# EAGLE schematic in3watch (EAGLE 6.4)

## Sheet 1 of 5: MCU
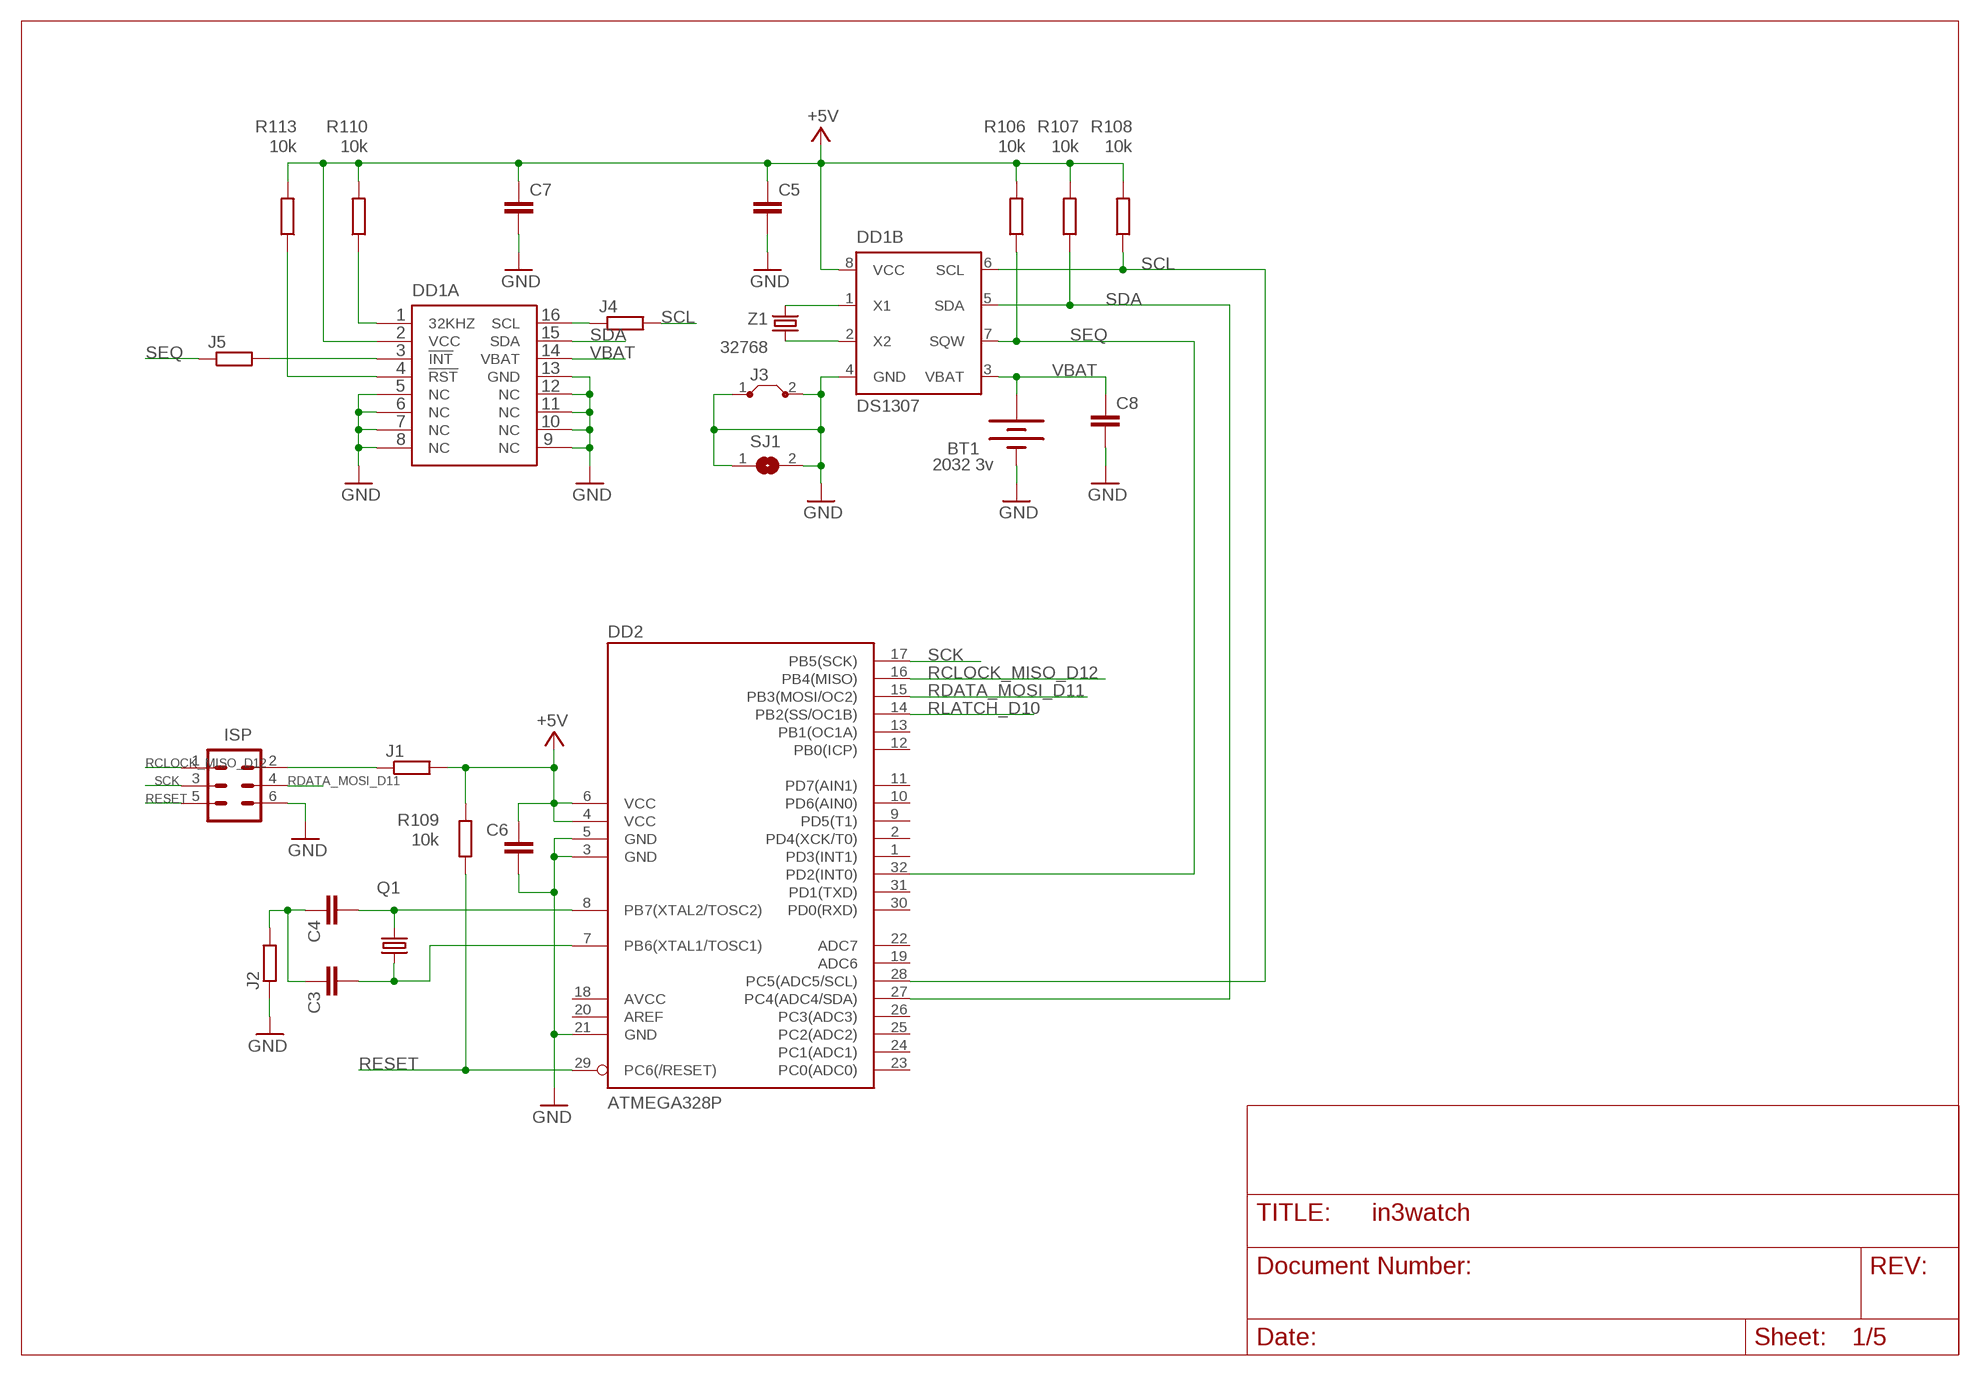
[diagram p0: schematic, sheet 1]

### Parts
BT1  2032 3v  BATTERY-20MM_PTH  [BATTCOM_20MM_PTH]
C3  C-EUC0805  [C0805]
C4  C-EUC0805  [C0805]
C5  C-EUC0805  [C0805]
C6  C-EUC0805  [C0805]
C7  C-EUC0805  [C0805]
C8  C-EUC3225  [C3225]
DD1A  DS3231SOIC-16W  [SOIC-16W]
DD1B  DS1307  [DIL08]
DD2  ATMEGA328P  MEGA8-AI  [TQFP32-08]
ISP  MA03-2  [MA03-2]
J1  R-EU_R1206  [R1206]
J2  R-EU_R1206  [R1206]
J3  J5MM  [05]
J4  R-EU_R1206W  [R1206W]
J5  R-EU_R1206W  [R1206W]
Q1  CRYSTALHC49U70  [HC49U70]
R106  10k  R-EU_R0805  [R0805]
R107  10k  R-EU_R0805  [R0805]
R108  10k  R-EU_R0805  [R0805]
R109  10k  R-EU_R0805  [R0805]
R110  10k  R-EU_R0805  [R0805]
R113  10k  R-EU_R0805  [R0805]
SJ1  SJ  [SJ]
Z1  32768  FC-12M  [FC-12M]

### Nets
+5V: C5.1 C6.1 C7.1 DD1A.2(VCC) DD1B.8(VCC) DD2.4(VCC) DD2.6(VCC) J1.2 R106.2 R107.2 R108.2 R109.2 R110.2 R113.2 ; also sheet 2
+5VISP: ISP.2 J1.1
GND: BT1.2(-) C5.2 C6.2 C7.2 C8.2 DD1A.5(NC) DD1A.6(NC) DD1A.7(NC) DD1A.8(NC) DD1A.9(NC) DD1A.10(NC) DD1A.11(NC) DD1A.12(NC) DD1A.13(GND) DD1B.4(GND) DD2.3(GND) DD2.5(GND) DD2.21(GND) ISP.6 J2.1 J3.1 J3.2 SJ1.1 SJ1.2 ; also sheet 2,4,5
N$31: DD1B.2(X2) Z1.P$1
N$33: DD1B.1(X1) Z1.P$2
N$72: C4.2 DD2.8(PB7(XTAL2/TOSC2)) Q1.1
N$76: C3.1 C4.1 J2.2
N$112: C3.2 DD2.7(PB6(XTAL1/TOSC1)) Q1.2
N$114: DD1A.1(32KHZ) R110.1
N$115: DD1A.4(!RST) R113.1
RCLOCK_MISO_D12: DD2.16(PB4(MISO)) ISP.1 ; also sheet 2
RDATA_MOSI_D11: DD2.15(PB3(MOSI/OC2)) ISP.4 ; also sheet 2
RESET: DD2.29(PC6(/RESET)) ISP.5 R109.1
RLATCH_D10: DD2.14(PB2(SS/OC1B)) ; also sheet 2
SCK: DD2.17(PB5(SCK)) ISP.3
SCL: DD1B.6(SCL) DD2.28(PC5(ADC5/SCL)) J4.2 R108.1
SCL_J: DD1A.16(SCL) J4.1
SDA: DD1A.15(SDA) DD1B.5(SDA) DD2.27(PC4(ADC4/SDA)) R107.1
SEQ: DD1B.7(SQW) DD2.32(PD2(INT0)) J5.1 R106.1
SEQ_J: DD1A.3(!INT) J5.2
VBAT: BT1.1(+) C8.1 DD1A.14(VBAT) DD1B.3(VBAT)
Unconnected: DD2.1(PD3(INT1)) DD2.2(PD4(XCK/T0)) DD2.9(PD5(T1)) DD2.10(PD6(AIN0)) DD2.11(PD7(AIN1)) DD2.12(PB0(ICP)) DD2.13(PB1(OC1A)) DD2.19(ADC6) DD2.20(AREF) DD2.22(ADC7) DD2.23(PC0(ADC0)) DD2.24(PC1(ADC1)) DD2.25(PC2(ADC2)) DD2.26(PC3(ADC3)) DD2.30(PD0(RXD)) DD2.31(PD1(TXD))

## Sheet 2 of 5: REG
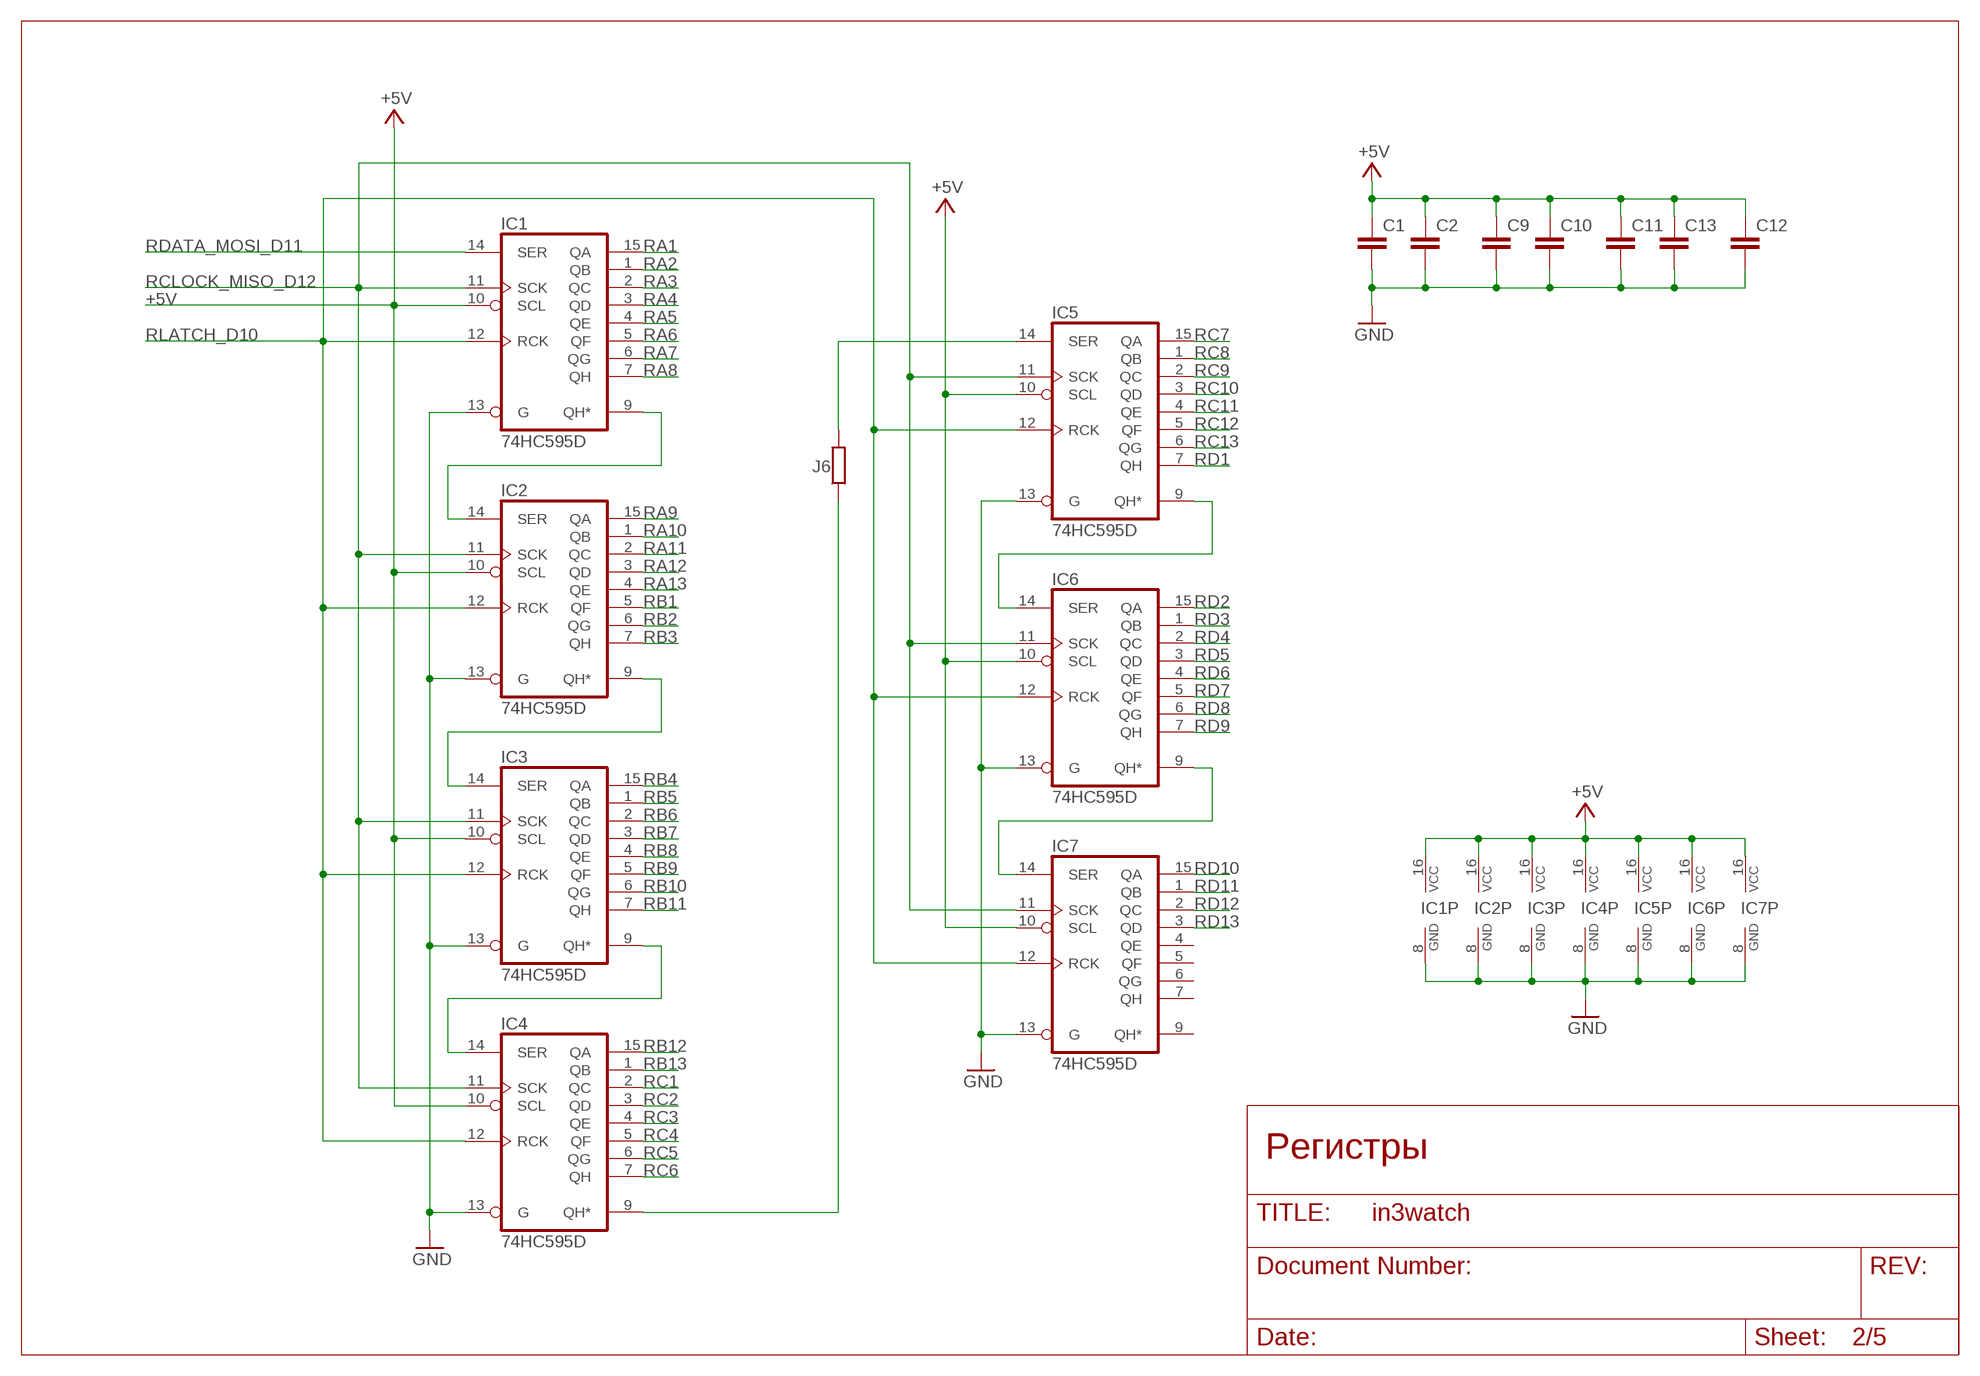
[diagram p1: schematic, sheet 2]

### Parts
C1  C-EUC0805  [C0805]
C2  C-EUC0805  [C0805]
C9  C-EUC0805  [C0805]
C10  C-EUC0805  [C0805]
C11  C-EUC0805  [C0805]
C12  C-EUC0805  [C0805]
C13  C-EUC0805  [C0805]
IC1  74HC595D  [SO16]
IC2  74HC595D  [SO16]
IC3  74HC595D  [SO16]
IC4  74HC595D  [SO16]
IC5  74HC595D  [SO16]
IC6  74HC595D  [SO16]
IC7  74HC595D  [SO16]
J6  R-EU_R1206W  [R1206W]

### Nets
+5V: C1.1 C2.1 C9.1 C10.1 C11.1 C12.1 C13.1 IC1.10(SCL) IC1.16(VCC) IC2.10(SCL) IC2.16(VCC) IC3.10(SCL) IC3.16(VCC) IC4.10(SCL) IC4.16(VCC) IC5.10(SCL) IC5.16(VCC) IC6.10(SCL) IC6.16(VCC) IC7.10(SCL) IC7.16(VCC) ; also sheet 1
GND: C1.2 C2.2 C9.2 C10.2 C11.2 C12.2 C13.2 IC1.8(GND) IC1.13(G) IC2.8(GND) IC2.13(G) IC3.8(GND) IC3.13(G) IC4.8(GND) IC4.13(G) IC5.8(GND) IC5.13(G) IC6.8(GND) IC6.13(G) IC7.8(GND) IC7.13(G) ; also sheet 1,4,5
N$17: IC5.14(SER) J6.2
RA1: IC1.15(QA) ; also sheet 4
RA2: IC1.1(QB) ; also sheet 4
RA3: IC1.2(QC) ; also sheet 4
RA4: IC1.3(QD) ; also sheet 4
RA5: IC1.4(QE) ; also sheet 4
RA6: IC1.5(QF) ; also sheet 4
RA7: IC1.6(QG) ; also sheet 4
RA8: IC1.7(QH) ; also sheet 4
RA9: IC2.15(QA) ; also sheet 4
RA10: IC2.1(QB) ; also sheet 4
RA11: IC2.2(QC) ; also sheet 4
RA12: IC2.3(QD) ; also sheet 4
RA13: IC2.4(QE) ; also sheet 4
RB1: IC2.5(QF) ; also sheet 4
RB2: IC2.6(QG) ; also sheet 4
RB3: IC2.7(QH) ; also sheet 4
RB4: IC3.15(QA) ; also sheet 4
RB5: IC3.1(QB) ; also sheet 4
RB6: IC3.2(QC) ; also sheet 4
RB7: IC3.3(QD) ; also sheet 4
RB8: IC3.4(QE) ; also sheet 4
RB9: IC3.5(QF) ; also sheet 4
RB10: IC3.6(QG) ; also sheet 4
RB11: IC3.7(QH) ; also sheet 4
RB12: IC4.15(QA) ; also sheet 4
RB13: IC4.1(QB) ; also sheet 4
RC1: IC4.2(QC) ; also sheet 4
RC2: IC4.3(QD) ; also sheet 4
RC3: IC4.4(QE) ; also sheet 4
RC4: IC4.5(QF) ; also sheet 4
RC5: IC4.6(QG) ; also sheet 4
RC6: IC4.7(QH) ; also sheet 4
RC7: IC5.15(QA) ; also sheet 5
RC8: IC5.1(QB) ; also sheet 5
RC9: IC5.2(QC) ; also sheet 5
RC10: IC5.3(QD) ; also sheet 5
RC11: IC5.4(QE) ; also sheet 5
RC12: IC5.5(QF) ; also sheet 5
RC13: IC5.6(QG) ; also sheet 5
RCLOCK_MISO_D12: IC1.11(SCK) IC2.11(SCK) IC3.11(SCK) IC4.11(SCK) IC5.11(SCK) IC6.11(SCK) IC7.11(SCK) ; also sheet 1
RD1: IC5.7(QH) ; also sheet 5
RD2: IC6.15(QA) ; also sheet 5
RD3: IC6.1(QB) ; also sheet 5
RD4: IC6.2(QC) ; also sheet 5
RD5: IC6.3(QD) ; also sheet 5
RD6: IC6.4(QE) ; also sheet 5
RD7: IC6.5(QF) ; also sheet 5
RD8: IC6.6(QG) ; also sheet 5
RD9: IC6.7(QH) ; also sheet 5
RD10: IC7.15(QA) ; also sheet 5
RD11: IC7.1(QB) ; also sheet 5
RD12: IC7.2(QC) ; also sheet 5
RD13: IC7.3(QD) ; also sheet 5
RDATA_MOSI_D11: IC1.14(SER) ; also sheet 1
RLATCH_D10: IC1.12(RCK) IC2.12(RCK) IC3.12(RCK) IC4.12(RCK) IC5.12(RCK) IC6.12(RCK) IC7.12(RCK) ; also sheet 1
SER2: IC1.9(QH*) IC2.14(SER)
SER3: IC2.9(QH*) IC3.14(SER)
SER4: IC3.9(QH*) IC4.14(SER)
SER5: IC4.9(QH*) J6.1
SER6: IC5.9(QH*) IC6.14(SER)
SER7: IC6.9(QH*) IC7.14(SER)
Unconnected: IC7.4(QE) IC7.5(QF) IC7.6(QG) IC7.7(QH) IC7.9(QH*)

### Notes on the sheet
- Регистры

## Sheet 3 of 5: DSPL
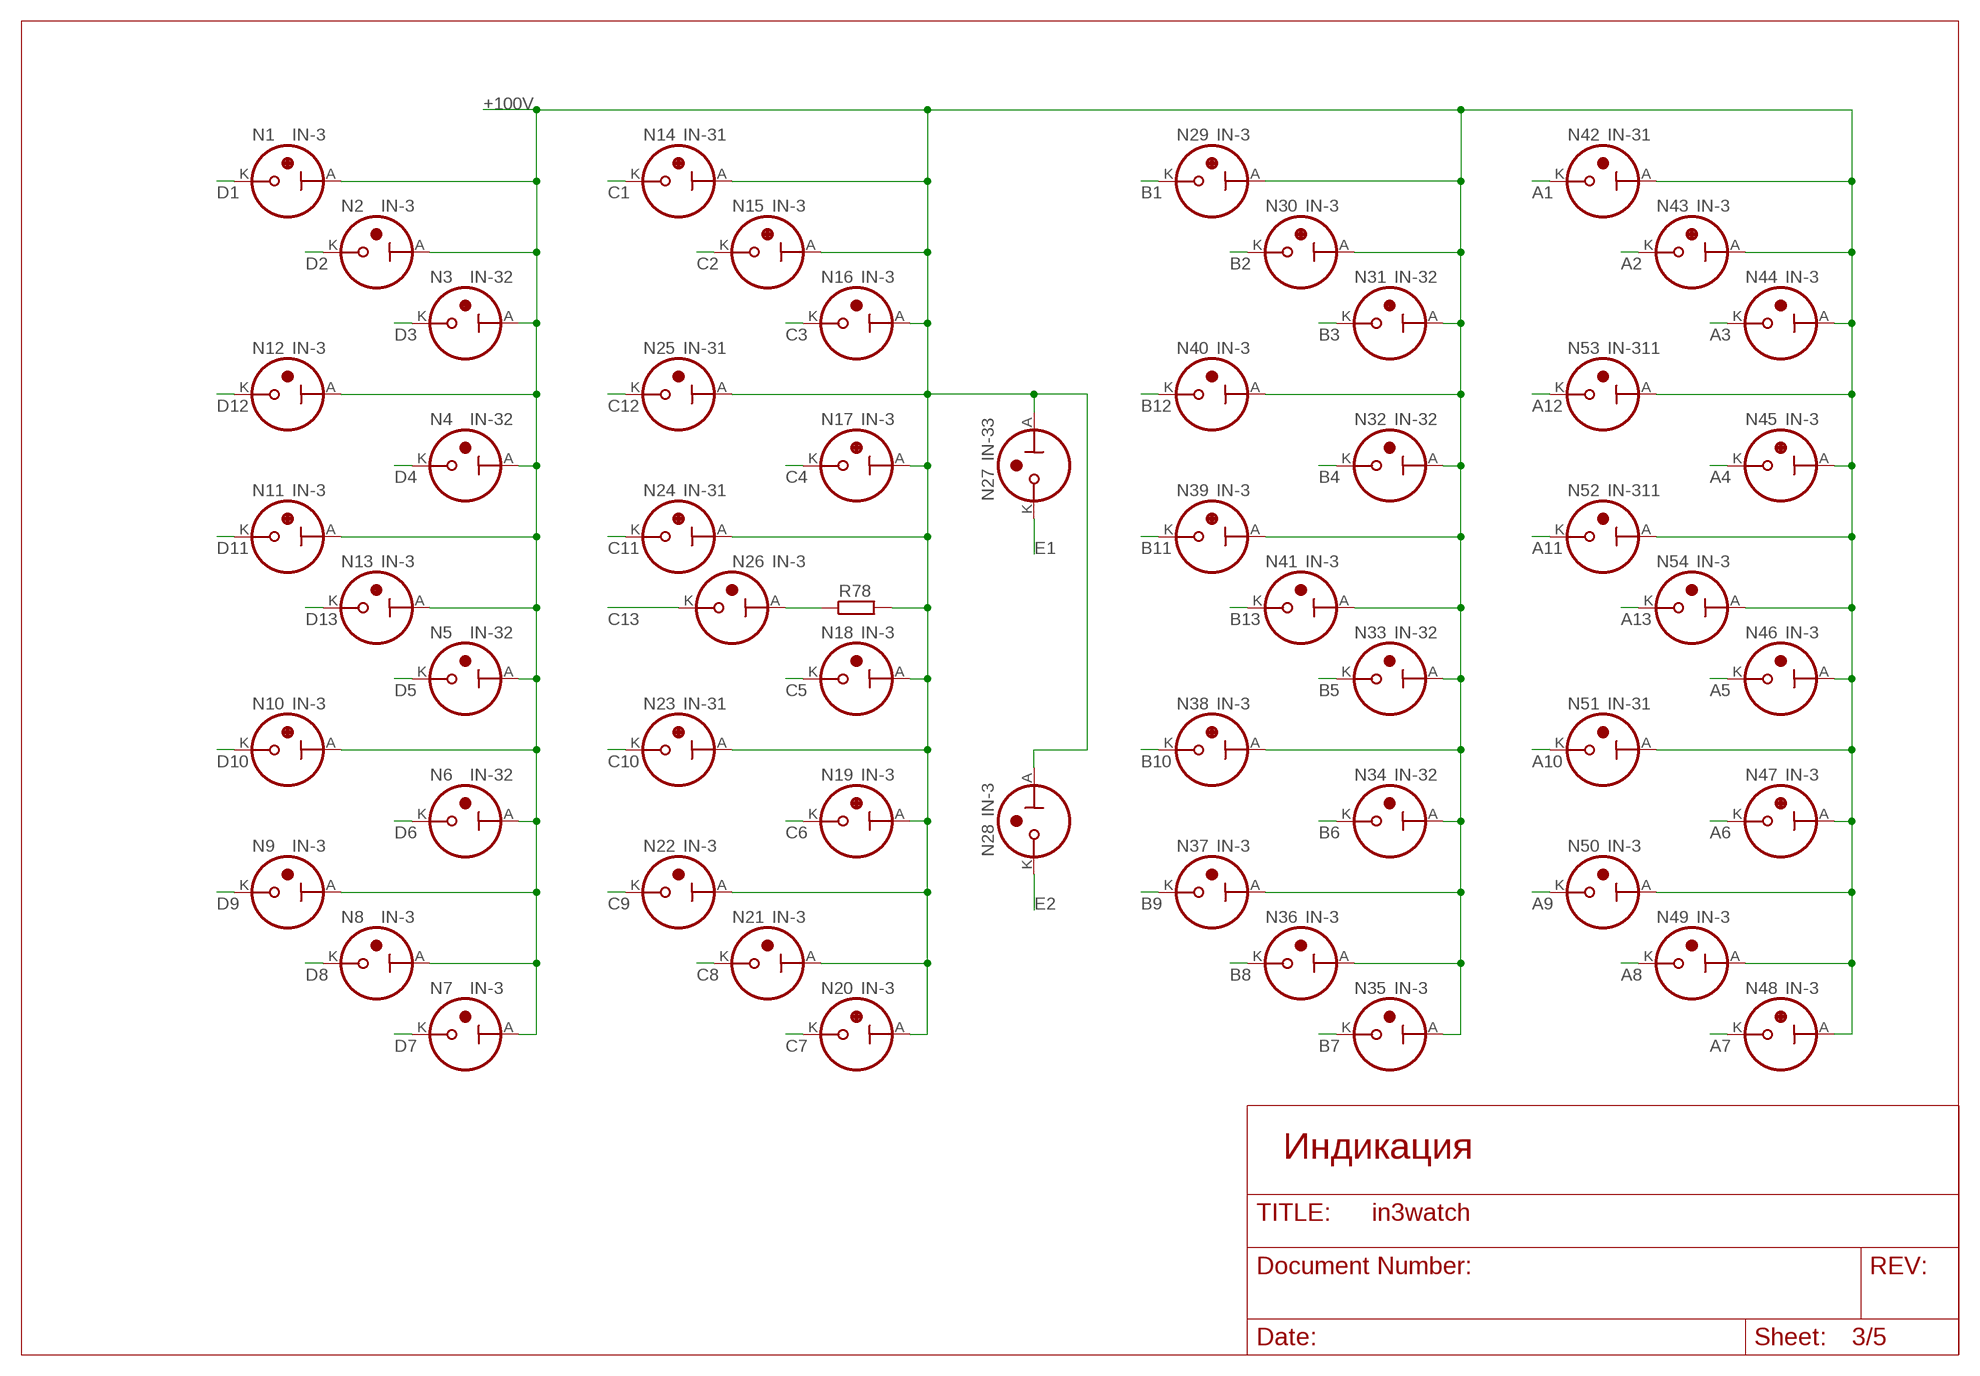
[diagram p2: schematic, sheet 3]

### Parts
N1  IN-3  [IN-3]
N2  IN-3  [IN-3]
N3  IN-32  [IN-3-2]
N4  IN-32  [IN-3-2]
N5  IN-32  [IN-3-2]
N6  IN-32  [IN-3-2]
N7  IN-3  [IN-3]
N8  IN-3  [IN-3]
N9  IN-3  [IN-3]
N10  IN-3  [IN-3]
N11  IN-3  [IN-3]
N12  IN-3  [IN-3]
N13  IN-3  [IN-3]
N14  IN-31  [IN-3-1]
N15  IN-3  [IN-3]
N16  IN-3  [IN-3]
N17  IN-3  [IN-3]
N18  IN-3  [IN-3]
N19  IN-3  [IN-3]
N20  IN-3  [IN-3]
N21  IN-3  [IN-3]
N22  IN-3  [IN-3]
N23  IN-31  [IN-3-1]
N24  IN-31  [IN-3-1]
N25  IN-31  [IN-3-1]
N26  IN-3  [IN-3]
N27  IN-33  [IN-3-3]
N28  IN-3  [IN-3]
N29  IN-3  [IN-3]
N30  IN-3  [IN-3]
N31  IN-32  [IN-3-2]
N32  IN-32  [IN-3-2]
N33  IN-32  [IN-3-2]
N34  IN-32  [IN-3-2]
N35  IN-3  [IN-3]
N36  IN-3  [IN-3]
N37  IN-3  [IN-3]
N38  IN-3  [IN-3]
N39  IN-3  [IN-3]
N40  IN-3  [IN-3]
N41  IN-3  [IN-3]
N42  IN-31  [IN-3-1]
N43  IN-3  [IN-3]
N44  IN-3  [IN-3]
N45  IN-3  [IN-3]
N46  IN-3  [IN-3]
N47  IN-3  [IN-3]
N48  IN-3  [IN-3]
N49  IN-3  [IN-3]
N50  IN-3  [IN-3]
N51  IN-31  [IN-3-1]
N52  IN-311  [IN-3-11]
N53  IN-311  [IN-3-11]
N54  IN-3  [IN-3]
R78  R-EU_0207/15  [0207/15]

### Nets
+100V: N1.A N2.A N3.A N4.A N5.A N6.A N7.A N8.A N9.A N10.A N11.A N12.A N13.A N14.A N15.A N16.A N17.A N18.A N19.A N20.A N21.A N22.A N23.A N24.A N25.A N27.A N28.A N29.A N30.A N31.A N32.A N33.A N34.A N35.A N36.A N37.A N38.A N39.A N40.A N41.A N42.A N43.A N44.A N45.A N46.A N47.A N48.A N49.A N50.A N51.A N52.A N53.A N54.A R78.2
A1: N42.K ; also sheet 4
A2: N43.K ; also sheet 4
A3: N44.K ; also sheet 4
A4: N45.K ; also sheet 4
A5: N46.K ; also sheet 4
A6: N47.K ; also sheet 4
A7: N48.K ; also sheet 4
A8: N49.K ; also sheet 4
A9: N50.K ; also sheet 4
A10: N51.K ; also sheet 4
A11: N52.K ; also sheet 4
A12: N53.K ; also sheet 4
A13: N54.K ; also sheet 4
B1: N29.K ; also sheet 4
B2: N30.K ; also sheet 4
B3: N31.K ; also sheet 4
B4: N32.K ; also sheet 4
B5: N33.K ; also sheet 4
B6: N34.K ; also sheet 4
B7: N35.K ; also sheet 4
B8: N36.K ; also sheet 4
B9: N37.K ; also sheet 4
B10: N38.K ; also sheet 4
B11: N39.K ; also sheet 4
B12: N40.K ; also sheet 4
B13: N41.K ; also sheet 4
C1: N14.K ; also sheet 4
C2: N15.K ; also sheet 4
C3: N16.K ; also sheet 4
C4: N17.K ; also sheet 4
C5: N18.K ; also sheet 4
C6: N19.K ; also sheet 4
C7: N20.K ; also sheet 5
C8: N21.K ; also sheet 5
C9: N22.K ; also sheet 5
C10: N23.K ; also sheet 5
C11: N24.K ; also sheet 5
C12: N25.K ; also sheet 5
C13: N26.K ; also sheet 5
D1: N1.K ; also sheet 5
D2: N2.K ; also sheet 5
D3: N3.K ; also sheet 5
D4: N4.K ; also sheet 5
D5: N5.K ; also sheet 5
D6: N6.K ; also sheet 5
D7: N7.K ; also sheet 5
D8: N8.K ; also sheet 5
D9: N9.K ; also sheet 5
D10: N10.K ; also sheet 5
D11: N11.K ; also sheet 5
D12: N12.K ; also sheet 5
D13: N13.K ; also sheet 5
E1: N27.K ; also sheet 5
E2: N28.K ; also sheet 5
N$77: N26.A R78.1

### Notes on the sheet
- Индикация

## Sheet 4 of 5: SW.1
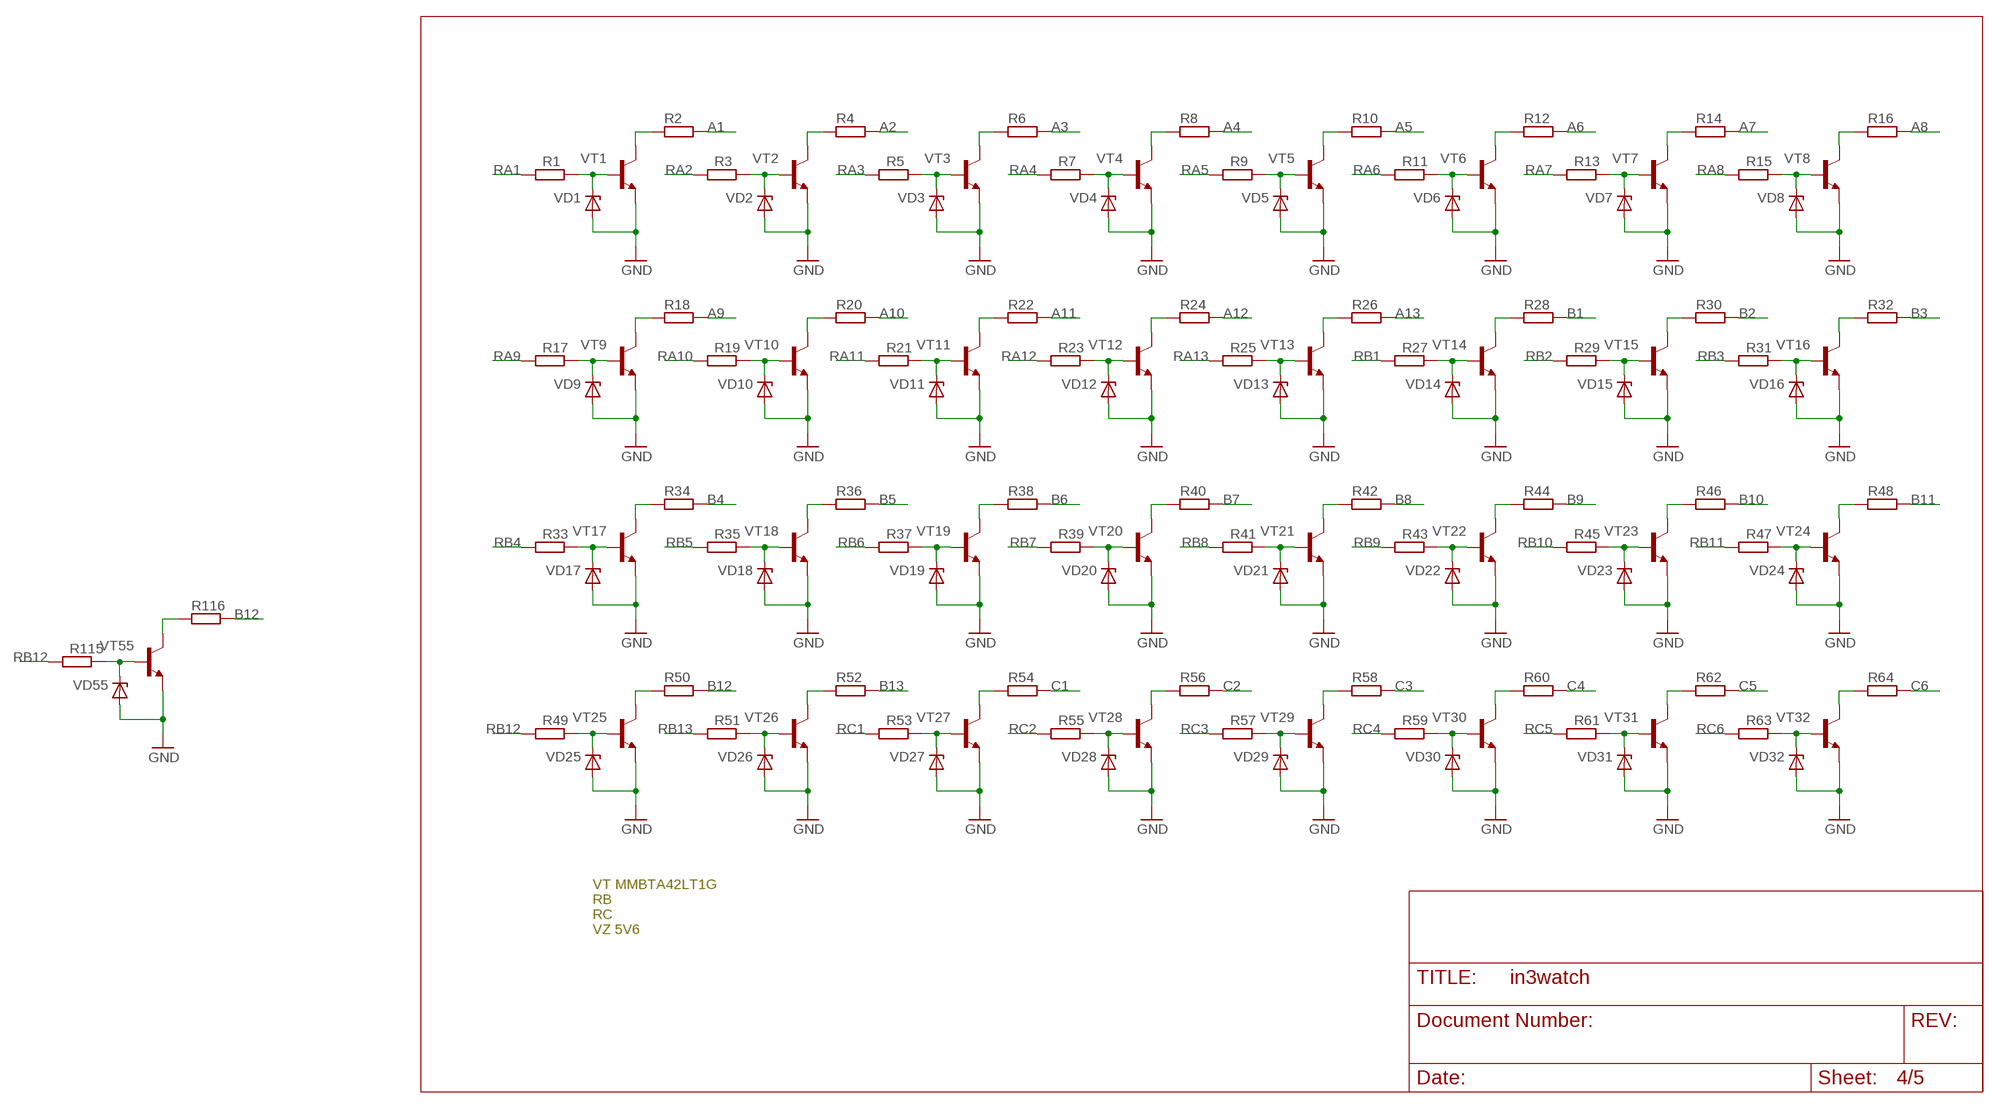
[diagram p3: schematic, sheet 4]

### Parts
R1  R-EU_R0805  [R0805]
R2  R-EU_0207/12  [0207/12]
R3  R-EU_R0805  [R0805]
R4  R-EU_0207/12  [0207/12]
R5  R-EU_R0805  [R0805]
R6  R-EU_0207/12  [0207/12]
R7  R-EU_R0805  [R0805]
R8  R-EU_0207/12  [0207/12]
R9  R-EU_R0805  [R0805]
R10  R-EU_0207/12  [0207/12]
R11  R-EU_R0805  [R0805]
R12  R-EU_0207/12  [0207/12]
R13  R-EU_R0805  [R0805]
R14  R-EU_0207/12  [0207/12]
R15  R-EU_R0805  [R0805]
R16  R-EU_0207/12  [0207/12]
R17  R-EU_R0805  [R0805]
R18  R-EU_0207/12  [0207/12]
R19  R-EU_R1206W  [R1206W]
R20  R-EU_0207/12  [0207/12]
R21  R-EU_R0805  [R0805]
R22  R-EU_0207/12  [0207/12]
R23  R-EU_R0805  [R0805]
R24  R-EU_0207/12  [0207/12]
R25  R-EU_R0805  [R0805]
R26  R-EU_0207/12  [0207/12]
R27  R-EU_R0805  [R0805]
R28  R-EU_0207/12  [0207/12]
R29  R-EU_R0805  [R0805]
R30  R-EU_0207/12  [0207/12]
R31  R-EU_R0805  [R0805]
R32  R-EU_0207/12  [0207/12]
R33  R-EU_R0805  [R0805]
R34  R-EU_0207/12  [0207/12]
R35  R-EU_M1206  [M1206]
R36  R-EU_0207/12  [0207/12]
R37  R-EU_R0805  [R0805]
R38  R-EU_0207/12  [0207/12]
R39  R-EU_R0805  [R0805]
R40  R-EU_0207/12  [0207/12]
R41  R-EU_R1206W  [R1206W]
R42  R-EU_0207/12  [0207/12]
R43  R-EU_R1206W  [R1206W]
R44  R-EU_0207/12  [0207/12]
R45  R-EU_R1206W  [R1206W]
R46  R-EU_0207/12  [0207/12]
R47  R-EU_R0805  [R0805]
R48  R-EU_0207/10  [0207/10]
R49  R-EU_R0805  [R0805]
R50  R-EU_0207/12  [0207/12]
R51  R-EU_R0805  [R0805]
R52  R-EU_0207/12  [0207/12]
R53  R-EU_R0805  [R0805]
R54  R-EU_0207/12  [0207/12]
R55  R-EU_R0805  [R0805]
R56  R-EU_0207/10  [0207/10]
R57  R-EU_R0805  [R0805]
R58  R-EU_0207/12  [0207/12]
R59  R-EU_R0805  [R0805]
R60  R-EU_0207/12  [0207/12]
R61  R-EU_R0805  [R0805]
R62  R-EU_0207/12  [0207/12]
R63  R-EU_R0805  [R0805]
R64  R-EU_0207/12  [0207/12]
R115  R-EU_R0603  [R0603]
R116  R-EU_R0603  [R0603]
VD1  ZENER-DIODESOD80C  [SOD80C]
VD2  ZENER-DIODESOD80C  [SOD80C]
VD3  ZENER-DIODESOD80C  [SOD80C]
VD4  ZENER-DIODESOD80C  [SOD80C]
VD5  ZENER-DIODESOD80C  [SOD80C]
VD6  ZENER-DIODESOD80C  [SOD80C]
VD7  ZENER-DIODESOD80C  [SOD80C]
VD8  ZENER-DIODESOD80C  [SOD80C]
VD9  ZENER-DIODESOD80C  [SOD80C]
VD10  ZENER-DIODESOD80C  [SOD80C]
VD11  ZENER-DIODESOD80C  [SOD80C]
VD12  ZENER-DIODESOD80C  [SOD80C]
VD13  ZENER-DIODESOD80C  [SOD80C]
VD14  ZENER-DIODESOD80C  [SOD80C]
VD15  ZENER-DIODESOD80C  [SOD80C]
VD16  ZENER-DIODESOD80C  [SOD80C]
VD17  ZENER-DIODESOD80C  [SOD80C]
VD18  ZENER-DIODESOD80C  [SOD80C]
VD19  ZENER-DIODESOD80C  [SOD80C]
VD20  ZENER-DIODESOD80C  [SOD80C]
VD21  ZENER-DIODESOD80C  [SOD80C]
VD22  ZENER-DIODESOD80C  [SOD80C]
VD23  ZENER-DIODESOD80C  [SOD80C]
VD24  ZENER-DIODESOD80C  [SOD80C]
VD25  ZENER-DIODESOD80C  [SOD80C]
VD26  ZENER-DIODESOD80C  [SOD80C]
VD27  ZENER-DIODESOD80C  [SOD80C]
VD28  ZENER-DIODESOD80C  [SOD80C]
VD29  ZENER-DIODESOD80C  [SOD80C]
VD30  ZENER-DIODESOD80C  [SOD80C]
VD31  ZENER-DIODESOD80C  [SOD80C]
VD32  ZENER-DIODESOD80C  [SOD80C]
VD55  ZENER-DIODESOD80C  [SOD80C]
VT1  BC849SMD  [SOT23-BEC]
VT2  BC849SMD  [SOT23-BEC]
VT3  BC849SMD  [SOT23-BEC]
VT4  BC849SMD  [SOT23-BEC]
VT5  BC849SMD  [SOT23-BEC]
VT6  BC849SMD  [SOT23-BEC]
VT7  BC849SMD  [SOT23-BEC]
VT8  BC849SMD  [SOT23-BEC]
VT9  BC849SMD  [SOT23-BEC]
VT10  BC849SMD  [SOT23-BEC]
VT11  BC849SMD  [SOT23-BEC]
VT12  BC849SMD  [SOT23-BEC]
VT13  BC849SMD  [SOT23-BEC]
VT14  BC849SMD  [SOT23-BEC]
VT15  BC849SMD  [SOT23-BEC]
VT16  BC849SMD  [SOT23-BEC]
VT17  BC849SMD  [SOT23-BEC]
VT18  BC849SMD  [SOT23-BEC]
VT19  BC849SMD  [SOT23-BEC]
VT20  BC849SMD  [SOT23-BEC]
VT21  BC849SMD  [SOT23-BEC]
VT22  BC849SMD  [SOT23-BEC]
VT23  BC849SMD  [SOT23-BEC]
VT24  BC849SMD  [SOT23-BEC]
VT25  BC849SMD  [SOT23-BEC]
VT26  BC849SMD  [SOT23-BEC]
VT27  BC849SMD  [SOT23-BEC]
VT28  BC849SMD  [SOT23-BEC]
VT29  BC849SMD  [SOT23-BEC]
VT30  BC849SMD  [SOT23-BEC]
VT31  BC849SMD  [SOT23-BEC]
VT32  BC849SMD  [SOT23-BEC]
VT55  BC849SMD  [SOT23-BEC]

### Nets
A1: R2.2 ; also sheet 3
A2: R4.2 ; also sheet 3
A3: R6.2 ; also sheet 3
A4: R8.2 ; also sheet 3
A5: R10.2 ; also sheet 3
A6: R12.2 ; also sheet 3
A7: R14.2 ; also sheet 3
A8: R16.2 ; also sheet 3
A9: R18.2 ; also sheet 3
A10: R20.2 ; also sheet 3
A11: R22.2 ; also sheet 3
A12: R24.2 ; also sheet 3
A13: R26.2 ; also sheet 3
B1: R28.2 ; also sheet 3
B2: R30.2 ; also sheet 3
B3: R32.2 ; also sheet 3
B4: R34.2 ; also sheet 3
B5: R36.2 ; also sheet 3
B6: R38.2 ; also sheet 3
B7: R40.2 ; also sheet 3
B8: R42.2 ; also sheet 3
B9: R44.2 ; also sheet 3
B10: R46.2 ; also sheet 3
B11: R48.2 ; also sheet 3
B12: R50.2 R116.2 ; also sheet 3
B13: R52.2 ; also sheet 3
C1: R54.2 ; also sheet 3
C2: R56.2 ; also sheet 3
C3: R58.2 ; also sheet 3
C4: R60.2 ; also sheet 3
C5: R62.2 ; also sheet 3
C6: R64.2 ; also sheet 3
GND: VD1.A VD2.A VD3.A VD4.A VD5.A VD6.A VD7.A VD8.A VD9.A VD10.A VD11.A VD12.A VD13.A VD14.A VD15.A VD16.A VD17.A VD18.A VD19.A VD20.A VD21.A VD22.A VD23.A VD24.A VD25.A VD26.A VD27.A VD28.A VD29.A VD30.A VD31.A VD32.A VD55.A VT1.E VT2.E VT3.E VT4.E VT5.E VT6.E VT7.E VT8.E VT9.E VT10.E VT11.E VT12.E VT13.E VT14.E VT15.E VT16.E VT17.E VT18.E VT19.E VT20.E VT21.E VT22.E VT23.E VT24.E VT25.E VT26.E VT27.E VT28.E VT29.E VT30.E VT31.E VT32.E VT55.E ; also sheet 1,2,5
N$1: R2.1 VT1.C
N$2: R1.2 VD1.C VT1.B
N$3: R34.1 VT17.C
N$4: R4.1 VT2.C
N$5: R3.2 VD2.C VT2.B
N$6: R18.1 VT9.C
N$7: R17.2 VD9.C VT9.B
N$8: R20.1 VT10.C
N$9: R19.2 VD10.C VT10.B
N$10: R22.1 VT11.C
N$11: R21.2 VD11.C VT11.B
N$12: R24.1 VT12.C
N$13: R23.2 VD12.C VT12.B
N$14: R26.1 VT13.C
N$15: R25.2 VD13.C VT13.B
N$16: R28.1 VT14.C
N$18: R6.1 VT3.C
N$19: R5.2 VD3.C VT3.B
N$20: R8.1 VT4.C
N$21: R7.2 VD4.C VT4.B
N$22: R10.1 VT5.C
N$23: R9.2 VD5.C VT5.B
N$24: R12.1 VT6.C
N$25: R11.2 VD6.C VT6.B
N$26: R14.1 VT7.C
N$27: R13.2 VD7.C VT7.B
N$28: R16.1 VT8.C
N$29: R15.2 VD8.C VT8.B
N$30: R27.2 VD14.C VT14.B
N$32: R33.2 VD17.C VT17.B
N$34: R30.1 VT15.C
N$35: R29.2 VD15.C VT15.B
N$36: R32.1 VT16.C
N$37: R31.2 VD16.C VT16.B
N$38: R36.1 VT18.C
N$39: R35.2 VD18.C VT18.B
N$40: R38.1 VT19.C
N$41: R37.2 VD19.C VT19.B
N$42: R40.1 VT20.C
N$43: R39.2 VD20.C VT20.B
N$44: R42.1 VT21.C
N$45: R41.2 VD21.C VT21.B
N$46: R44.1 VT22.C
N$47: R43.2 VD22.C VT22.B
N$48: R46.1 VT23.C
N$49: R45.2 VD23.C VT23.B
N$50: R48.1 VT24.C
N$51: R47.2 VD24.C VT24.B
N$52: R50.1 VT25.C
N$53: R49.2 VD25.C VT25.B
N$54: R52.1 VT26.C
N$55: R51.2 VD26.C VT26.B
N$56: R54.1 VT27.C
N$57: R53.2 VD27.C VT27.B
N$58: R56.1 VT28.C
N$59: R55.2 VD28.C VT28.B
N$60: R58.1 VT29.C
N$61: R57.2 VD29.C VT29.B
N$62: R60.1 VT30.C
N$63: R59.2 VD30.C VT30.B
N$64: R62.1 VT31.C
N$65: R61.2 VD31.C VT31.B
N$66: R64.1 VT32.C
N$67: R63.2 VD32.C VT32.B
N$117: R116.1 VT55.C
N$118: R115.2 VD55.C VT55.B
RA1: R1.1 ; also sheet 2
RA2: R3.1 ; also sheet 2
RA3: R5.1 ; also sheet 2
RA4: R7.1 ; also sheet 2
RA5: R9.1 ; also sheet 2
RA6: R11.1 ; also sheet 2
RA7: R13.1 ; also sheet 2
RA8: R15.1 ; also sheet 2
RA9: R17.1 ; also sheet 2
RA10: R19.1 ; also sheet 2
RA11: R21.1 ; also sheet 2
RA12: R23.1 ; also sheet 2
RA13: R25.1 ; also sheet 2
RB1: R27.1 ; also sheet 2
RB2: R29.1 ; also sheet 2
RB3: R31.1 ; also sheet 2
RB4: R33.1 ; also sheet 2
RB5: R35.1 ; also sheet 2
RB6: R37.1 ; also sheet 2
RB7: R39.1 ; also sheet 2
RB8: R41.1 ; also sheet 2
RB9: R43.1 ; also sheet 2
RB10: R45.1 ; also sheet 2
RB11: R47.1 ; also sheet 2
RB12: R49.1 R115.1 ; also sheet 2
RB13: R51.1 ; also sheet 2
RC1: R53.1 ; also sheet 2
RC2: R55.1 ; also sheet 2
RC3: R57.1 ; also sheet 2
RC4: R59.1 ; also sheet 2
RC5: R61.1 ; also sheet 2
RC6: R63.1 ; also sheet 2

### Notes on the sheet
- VT MMBTA42LT1G
  RB
  RC
  VZ 5V6

## Sheet 5 of 5: SW.2
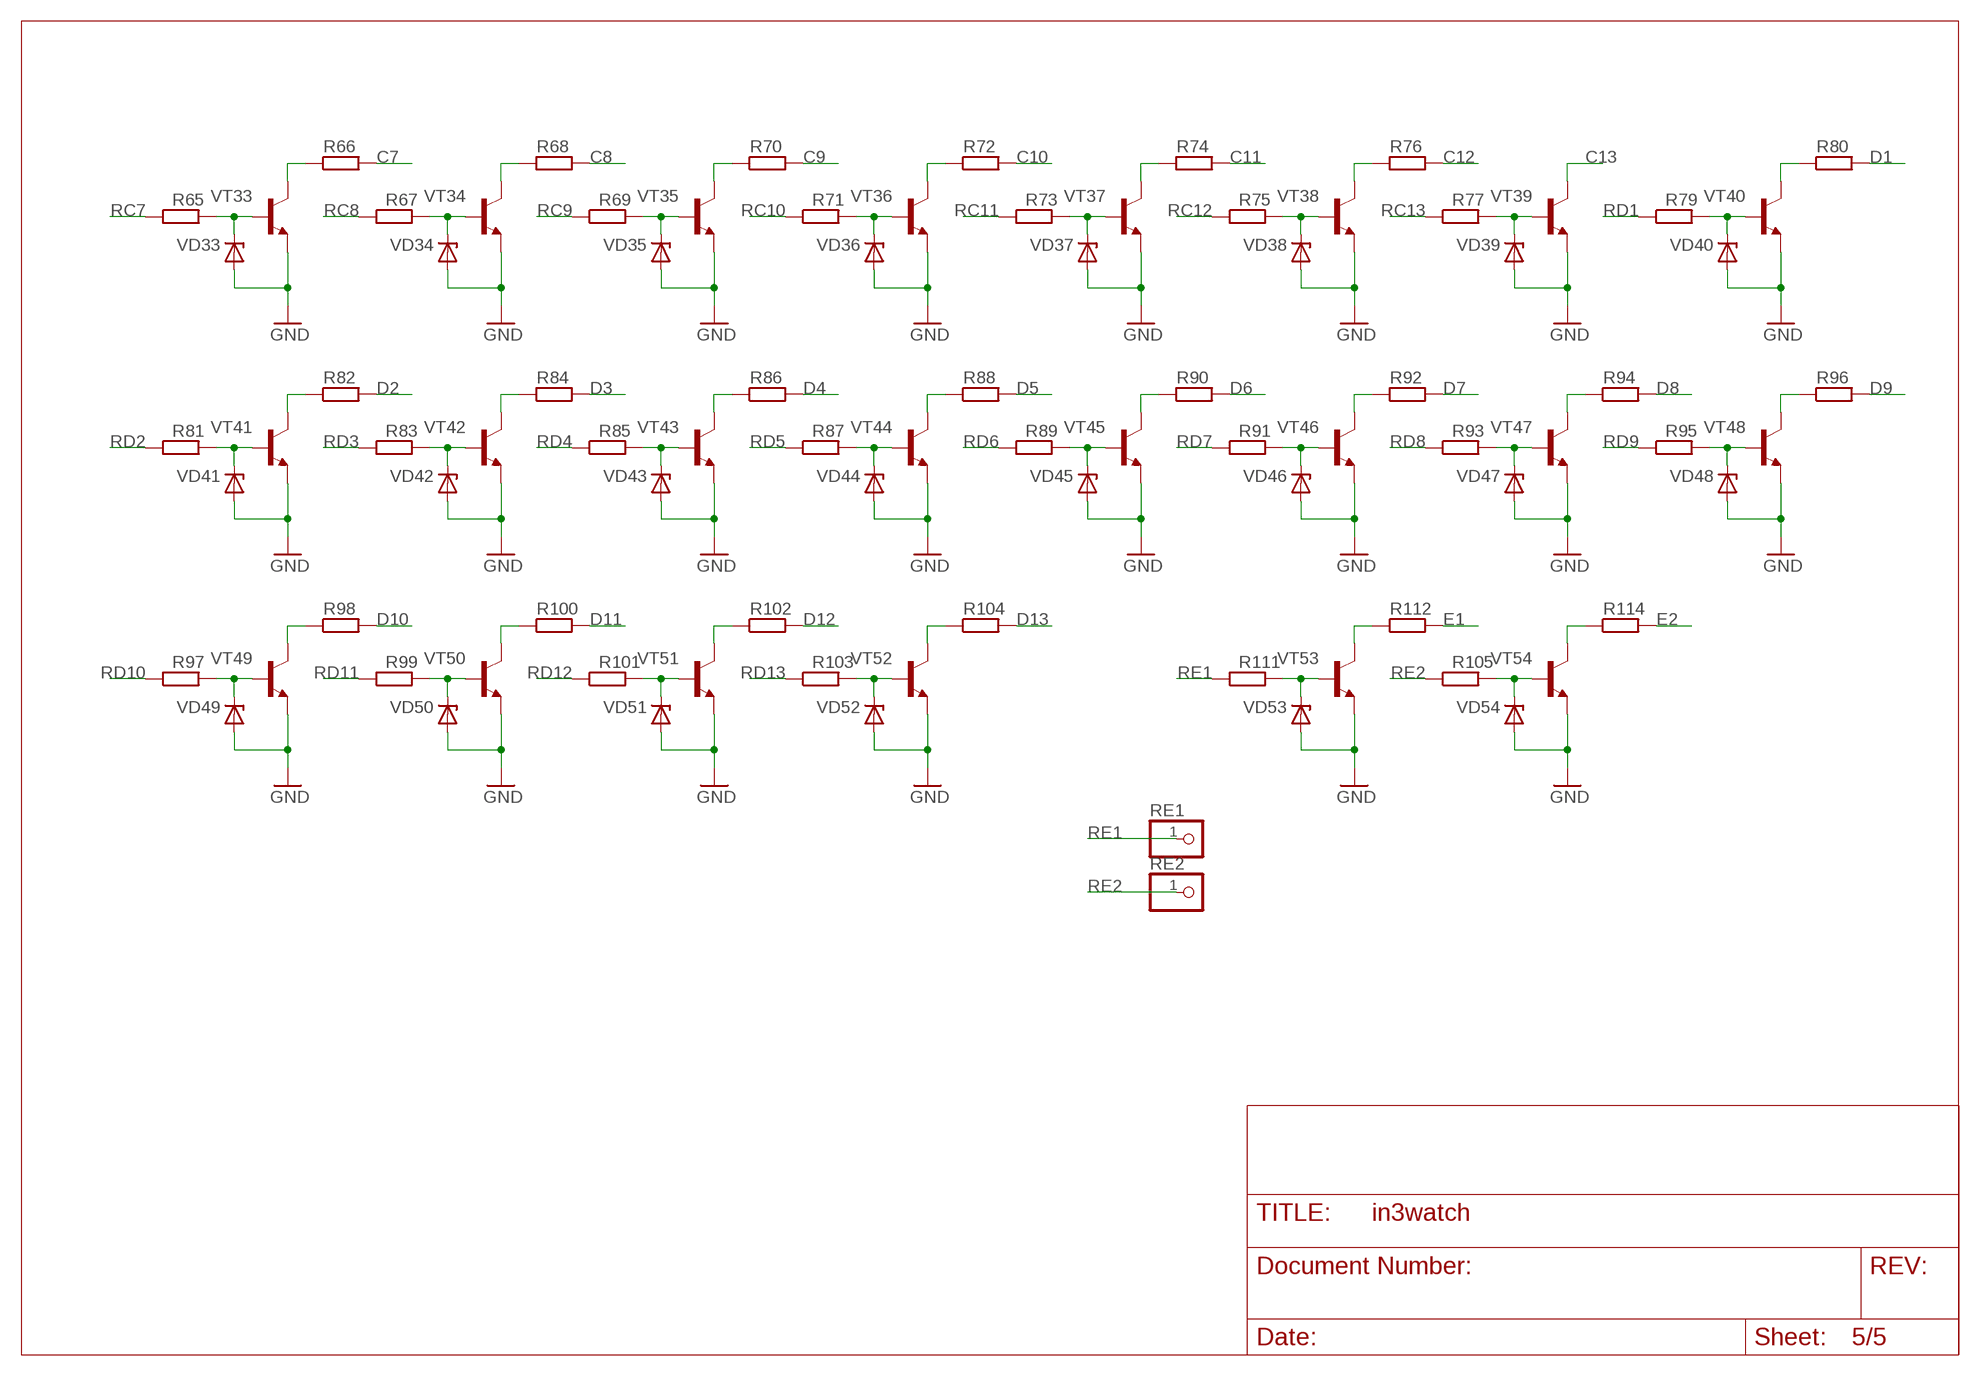
[diagram p4: schematic, sheet 5]

### Parts
R65  R-EU_R0805  [R0805]
R66  R-EU_0207/12  [0207/12]
R67  R-EU_R0805  [R0805]
R68  R-EU_0207/12  [0207/12]
R69  R-EU_R0805  [R0805]
R70  R-EU_0207/12  [0207/12]
R71  R-EU_R0805  [R0805]
R72  R-EU_0207/12  [0207/12]
R73  R-EU_R0805  [R0805]
R74  R-EU_0207/12  [0207/12]
R75  R-EU_R1206W  [R1206W]
R76  R-EU_0207/10  [0207/10]
R77  R-EU_R0805  [R0805]
R79  R-EU_R0805  [R0805]
R80  R-EU_0207/12  [0207/12]
R81  R-EU_R0805  [R0805]
R82  R-EU_0207/12  [0207/12]
R83  R-EU_R0805  [R0805]
R84  R-EU_0207/12  [0207/12]
R85  R-EU_R0805  [R0805]
R86  R-EU_0207/12  [0207/12]
R87  R-EU_R0805  [R0805]
R88  R-EU_0207/12  [0207/12]
R89  R-EU_R0805  [R0805]
R90  R-EU_0207/12  [0207/12]
R91  R-EU_0207/12  [0207/12]
R92  R-EU_0207/12  [0207/12]
R93  R-EU_R0805  [R0805]
R94  R-EU_0207/12  [0207/12]
R95  R-EU_R0805  [R0805]
R96  R-EU_0207/12  [0207/12]
R97  R-EU_R0805  [R0805]
R98  R-EU_0207/12  [0207/12]
R99  R-EU_R0805  [R0805]
R100  R-EU_0207/12  [0207/12]
R101  R-EU_R0805  [R0805]
R102  R-EU_0207/12  [0207/12]
R103  R-EU_R0805  [R0805]
R104  R-EU_0207/15  [0207/15]
R105  R-EU_R0805  [R0805]
R111  R-EU_R0805  [R0805]
R112  R-EU_M0805  [M0805]
R114  R-EU_M0805  [M0805]
RE1  PINHD-1X1  [1X01]
RE2  PINHD-1X1  [1X01]
VD33  ZENER-DIODESOD80C  [SOD80C]
VD34  ZENER-DIODESOD80C  [SOD80C]
VD35  ZENER-DIODESOD80C  [SOD80C]
VD36  ZENER-DIODESOD80C  [SOD80C]
VD37  ZENER-DIODESOD80C  [SOD80C]
VD38  ZENER-DIODESOD80C  [SOD80C]
VD39  ZENER-DIODESOD80C  [SOD80C]
VD40  ZENER-DIODESOD80C  [SOD80C]
VD41  ZENER-DIODESOD80C  [SOD80C]
VD42  ZENER-DIODESOD80C  [SOD80C]
VD43  ZENER-DIODESOD80C  [SOD80C]
VD44  ZENER-DIODESOD80C  [SOD80C]
VD45  ZENER-DIODESOD80C  [SOD80C]
VD46  ZENER-DIODESOD80C  [SOD80C]
VD47  ZENER-DIODESOD80C  [SOD80C]
VD48  ZENER-DIODESOD80C  [SOD80C]
VD49  ZENER-DIODESOD80C  [SOD80C]
VD50  ZENER-DIODESOD80C  [SOD80C]
VD51  ZENER-DIODESOD80C  [SOD80C]
VD52  ZENER-DIODESOD80C  [SOD80C]
VD53  ZENER-DIODESOD80C  [SOD80C]
VD54  ZENER-DIODESOD80C  [SOD80C]
VT33  BC849SMD  [SOT23-BEC]
VT34  BC849SMD  [SOT23-BEC]
VT35  BC849SMD  [SOT23-BEC]
VT36  BC849SMD  [SOT23-BEC]
VT37  BC849SMD  [SOT23-BEC]
VT38  BC849SMD  [SOT23-BEC]
VT39  BC849SMD  [SOT23-BEC]
VT40  BC849SMD  [SOT23-BEC]
VT41  BC849SMD  [SOT23-BEC]
VT42  BC849SMD  [SOT23-BEC]
VT43  BC849SMD  [SOT23-BEC]
VT44  BC849SMD  [SOT23-BEC]
VT45  BC849SMD  [SOT23-BEC]
VT46  BC849SMD  [SOT23-BEC]
VT47  BC849SMD  [SOT23-BEC]
VT48  BC849SMD  [SOT23-BEC]
VT49  BC849SMD  [SOT23-BEC]
VT50  BC849SMD  [SOT23-BEC]
VT51  BC849SMD  [SOT23-BEC]
VT52  BC849SMD  [SOT23-BEC]
VT53  BC849SMD  [SOT23-BEC]
VT54  BC849SMD  [SOT23-BEC]

### Nets
C7: R66.2 ; also sheet 3
C8: R68.2 ; also sheet 3
C9: R70.2 ; also sheet 3
C10: R72.2 ; also sheet 3
C11: R74.2 ; also sheet 3
C12: R76.2 ; also sheet 3
C13: VT39.C ; also sheet 3
D1: R80.2 ; also sheet 3
D2: R82.2 ; also sheet 3
D3: R84.2 ; also sheet 3
D4: R86.2 ; also sheet 3
D5: R88.2 ; also sheet 3
D6: R90.2 ; also sheet 3
D7: R92.2 ; also sheet 3
D8: R94.2 ; also sheet 3
D9: R96.2 ; also sheet 3
D10: R98.2 ; also sheet 3
D11: R100.2 ; also sheet 3
D12: R102.2 ; also sheet 3
D13: R104.2 ; also sheet 3
E1: R112.2 ; also sheet 3
E2: R114.2 ; also sheet 3
GND: VD33.A VD34.A VD35.A VD36.A VD37.A VD38.A VD39.A VD40.A VD41.A VD42.A VD43.A VD44.A VD45.A VD46.A VD47.A VD48.A VD49.A VD50.A VD51.A VD52.A VD53.A VD54.A VT33.E VT34.E VT35.E VT36.E VT37.E VT38.E VT39.E VT40.E VT41.E VT42.E VT43.E VT44.E VT45.E VT46.E VT47.E VT48.E VT49.E VT50.E VT51.E VT52.E VT53.E VT54.E ; also sheet 1,2,4
N$68: R66.1 VT33.C
N$69: R65.2 VD33.C VT33.B
N$70: R68.1 VT34.C
N$71: R67.2 VD34.C VT34.B
N$73: R112.1 VT53.C
N$74: R70.1 VT35.C
N$75: R69.2 VD35.C VT35.B
N$78: R72.1 VT36.C
N$79: R71.2 VD36.C VT36.B
N$80: R74.1 VT37.C
N$81: R73.2 VD37.C VT37.B
N$82: R76.1 VT38.C
N$83: R75.2 VD38.C VT38.B
N$84: R111.2 VD53.C VT53.B
N$85: R77.2 VD39.C VT39.B
N$86: R80.1 VT40.C
N$87: R79.2 VD40.C VT40.B
N$88: R82.1 VT41.C
N$89: R81.2 VD41.C VT41.B
N$90: R84.1 VT42.C
N$91: R83.2 VD42.C VT42.B
N$92: R86.1 VT43.C
N$93: R85.2 VD43.C VT43.B
N$94: R88.1 VT44.C
N$95: R87.2 VD44.C VT44.B
N$96: R90.1 VT45.C
N$97: R89.2 VD45.C VT45.B
N$98: R92.1 VT46.C
N$99: R91.2 VD46.C VT46.B
N$100: R94.1 VT47.C
N$101: R93.2 VD47.C VT47.B
N$102: R96.1 VT48.C
N$103: R95.2 VD48.C VT48.B
N$104: R98.1 VT49.C
N$105: R97.2 VD49.C VT49.B
N$106: R100.1 VT50.C
N$107: R99.2 VD50.C VT50.B
N$108: R102.1 VT51.C
N$109: R101.2 VD51.C VT51.B
N$110: R104.1 VT52.C
N$111: R103.2 VD52.C VT52.B
N$113: R114.1 VT54.C
N$116: R105.2 VD54.C VT54.B
RC7: R65.1 ; also sheet 2
RC8: R67.1 ; also sheet 2
RC9: R69.1 ; also sheet 2
RC10: R71.1 ; also sheet 2
RC11: R73.1 ; also sheet 2
RC12: R75.1 ; also sheet 2
RC13: R77.1 ; also sheet 2
RD1: R79.1 ; also sheet 2
RD2: R81.1 ; also sheet 2
RD3: R83.1 ; also sheet 2
RD4: R85.1 ; also sheet 2
RD5: R87.1 ; also sheet 2
RD6: R89.1 ; also sheet 2
RD7: R91.1 ; also sheet 2
RD8: R93.1 ; also sheet 2
RD9: R95.1 ; also sheet 2
RD10: R97.1 ; also sheet 2
RD11: R99.1 ; also sheet 2
RD12: R101.1 ; also sheet 2
RD13: R103.1 ; also sheet 2
RE1: R111.1 RE1.1
RE2: R105.1 RE2.1

## Power pins joined to a net without a drawn wire
AVCC: DD2.18(AVCC)

## Library data of the parts
BT1 = SparkFun-Batteries:BATTERY: Battery - Single Cell A variety of battery chemistries, sizes, and footprints. Device List: 20MM_PTH - Coin Cell Battery Holder - 20mm (PTH) <https://www.sparkfun.com/products/783> 6.8MM_PTH - Coin Cell Battery Holder - 6.8MM(SMD) <https://www.digikey.com/product-detail/en/seiko-instruments/MS621FE-FL11E/728-1057-ND/1889208?WT.srch=1&gclid=CNOQ5a6LzdQCFZS2wAodXCkE0g> 12MM_SMD - Coin Cell Battery Holder - 12mm (SMD) <https://www.sparkfun.com/products/10592> 12MM_PTH - Coin Cell Battery Holder - 12mm (PTH) <https://www.sparkfun.com/products/7948> 20MM_SMD - 20mm Coin Cell Battery Holder (SMD) (2 legs) Used on the Big Time Watch Kit <https://www.sparkfun.com/products/11734> 20MM_SMD_4LEGS - Coin Cell Battery Holder - 20mm (SMD) <https://www.sparkfun.com/products/11892> 20MM_SMD_4LEGS_OVERPASTE - Coin Cell Battery Holder - 20mm (SMD) <https://www.sparkfun.com/products/11892> (Over-paste on the legs) 24.5MM_PTH - Coin Cell Battery Holder - 24.5mm (PTH) <https://www.sparkfun.com/products/8863> 9V - 9V Battery Holder - PC Mount Used on the SparkFun SparkPunk Sound Kit <https://www.sparkfun.com/products/11177> and SparkFun SparkPunk Sequencer Kit <https://www.sparkfun.com/products/12707> 18650 - Battery Holder - 18650 (PTH) <https://www.sparkfun.com/products/13113> AA - Battery Holder - 1xAA (PTH) <https://www.sparkfun.com/products/7949> AAA - Battery Holder - 1xAAA (PTH) <https://www.sparkfun.com/products/12718> AA_KIT - Battery Holder - 1xAA (PTH) <https://www.sparkfun.com/products/7949> Special kit package - pads only have exposed copper on one side of the board. AAA_KIT - Battery Holder - 1xAAA (PTH) <https://www.sparkfun.com/products/12718> Special kit package - pads only have exposed copper on one side of the board.; PROD_ID: BATT-09031; SF_SKU: PRT-00783
C1-C13 = rcl:C-EU: CAPACITOR, European symbol
DD1A = DS3231_industrialberry:DS3231
DD1B = ds1307_pcf8583:DS1307: I2C-Bus CLOCK/CALENDAR
DD2 = atmel:MEGA8: MICROCONTROLLER 8 Kbytes FLASH, 1 kbytes SRAM, 512 bytes EEPROM, USART, 6-channel 10 bit ADC, 2-channel 8 bit ADC Pin compatible with Atmega48, ATMega88, ATMega168 Source: avr.lbr; MPN: ATMEGA8-16AU; OC_FARNELL: 9171371; OC_NEWARK: 73M8863
IC1-IC7 = 74xx-eu:74*595: 8-bit SHIFT REGISTER, output latch
ISP = con-lstb:MA03-2: PIN HEADER
J1 J2 J4-J6 R1-R116 = rcl:R-EU_: RESISTOR, European symbol
J3 = in3wlbr:J: Bridge
N1 N2 N7-N13 N15-N22 N26 N28-N30 N35-N41 N43-N50 N54 = in3:IN-3: IN-3: nixie bulb
N3-N6 N14 N23-N25 N27 N31-N34 N42 N51-N53 = in3-mod:IN-3: IN-3: nixie bulb
Q1 = crystal:CRYSTAL: CRYSTAL; OC_FARNELL: unknown; OC_NEWARK: unknown
RE1 RE2 = pinhead:PINHD-1X1: PIN HEADER
SJ1 = jumper:SJ: SMD solder JUMPER
VD1-VD55 = diode:ZENER-DIODE: Z-Diode
VT1-VT55 = transistor-npn:BC849*: NPN Transistor
Z1 = zq:FC-12M: kHz RANGE CRYSTAL UNIT LOW PROFILE SMD Source: Epson Toyocom FC-12M.pdf